# Altium project ARM_V2.PrjPcb (part 2 of 2)

## Sheet POWER.SchDoc: Arm - Power
size Letter; DrawnBy: K.Hong; Organization: UW Robotics; Address1: 200 University Avenue; Address2: Waterloo; Address3: Ontario; Address4: Canada N2L 3G6; SheetNumber: 5; SheetTotal: 9
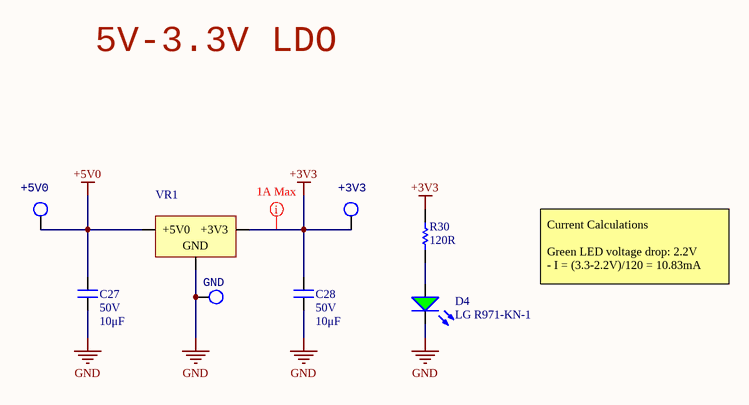
[diagram p5: POWER.SchDoc]

### Parts
+3V3  TESTPOINT_LOOP  [TESTPOINT_LOOP]  (value not drawn)
+5V0  TESTPOINT_LOOP  [TESTPOINT_LOOP]  (value not drawn)
C27  value 10μF  Voltage Rating: 50V  [CAPC1206(3216)]  (hidden comment: 10uF)
C28  value 10μF  Voltage Rating: 50V  [CAPC1206(3216)]  (hidden comment: 10uF)
D4  LG R971-KN-1  [LED_0805_LINE]
GND  TESTPOINT_LOOP  [TESTPOINT_LOOP]  (value not drawn)
R30  value 120R  [RESC0603(1608)_N]  (hidden comment: RES_120R_0603)
VR1  5V0_3V3_LDO  [D2PAK_M]  (value not drawn)

### Nets
+3V3: +3V3.1 C28.1 R30.2 VR1.2(+3V3)
+5V0: +5V0.1 C27.1 VR1.3(+5V0)
GND: C27.2 C28.2 D4.2(K) GND.1 VR1.1(GND)
NetD4_1: D4.1(A) R30.1

### Layout directives
mark named 1A Max: +3V3

### Notes on the sheet
- 5V-3.3V LDO
- Current Calculations
  Green LED voltage drop: 2.2V
  - I = (3.3-2.2V)/120 = 10.83mA
- Title
- Size:
- Date:
- Letter
- Drawn By:
- Sheet
- of
- File:

### Library data of the parts
+3V3 +5V0 GND = TESTPOINT_LOOP: Loop testpoint through-hole pad; Manufacturer Part Number 1: 5002; Manufacturer 1: Keystone Electronics; Supplier Part Number 1: 36-5002-ND; Supplier 1: Digi-Key; Mount: Through Hole
C27 C28 = CAP_10uF_50V_1206: CAP CER 10UF 50V X5R 1206; Manufacturer Part Numer 1: GRT31CR61H106KE01L; Manufacturer 1: Murata; Dimensions: 0.126" L x 0.063" W (3.20mm x 1.6mm); Package: 1206 (3216 Metric); Supplier Part Number 1: 490-12456-1-ND; Supplier 1: Digi-Key; Mount: Surface Mount; Case Code (Imperial): 1206; Case Code (Metric): 3216; Manufacturer Part Number 1: GRT31CR61H106KE01L; Dielectric: X5R
D4 = DIO_LED_G: LED GREEN DIFFUSED 0805 SMD; Manufacturer 1: OSRAM; Forward Voltage Drop: 2.2V; Package: 0805 (2012 Metric); Supplier Part Number 1: 475-1410-1-ND; Supplier 1: Digi-Key; Manufacturer Part Number 1: LG R971-KN-1; Mount: Surface Mount
R30 = RES_120R_0603: RES SMD 120 OHM 5% 1/10W 0603; Manufacturer: Yageo; MPN: RC0603JR-07120RL; Package: 0603 (1608 Metric); Dimensions: 0.063" L x 0.031" W (1.60mm x 0.80mm); Tolerance: 5%; Supplier Part Number 1: 311-120GRCT-ND; Supplier 1: Digi-Key
VR1 = 5V0_3V3_LDO: IC REG LINEAR 3.3V 1A DPAK; Manufacturer Part Number 1: NCP1117DT33T5G; Manufacturer 1: ON Semiconductor; Current Output: 1A; Supplier Part Number 1: NCP1117DT33T5GOSCT-ND; Supplier 1: Digi-Key; Mount: Surface Mount

## Sheet SPI Encoders.SchDoc: Arm - SPI Encoders
size Letter; DrawnBy: N.Chapman, K.Hong; Organization: UW Robotics; Address1: 200 University Avenue; Address2: Waterloo; Address3: Ontario; Address4: Canada N2L 3G6; SheetNumber: 9; SheetTotal: 9
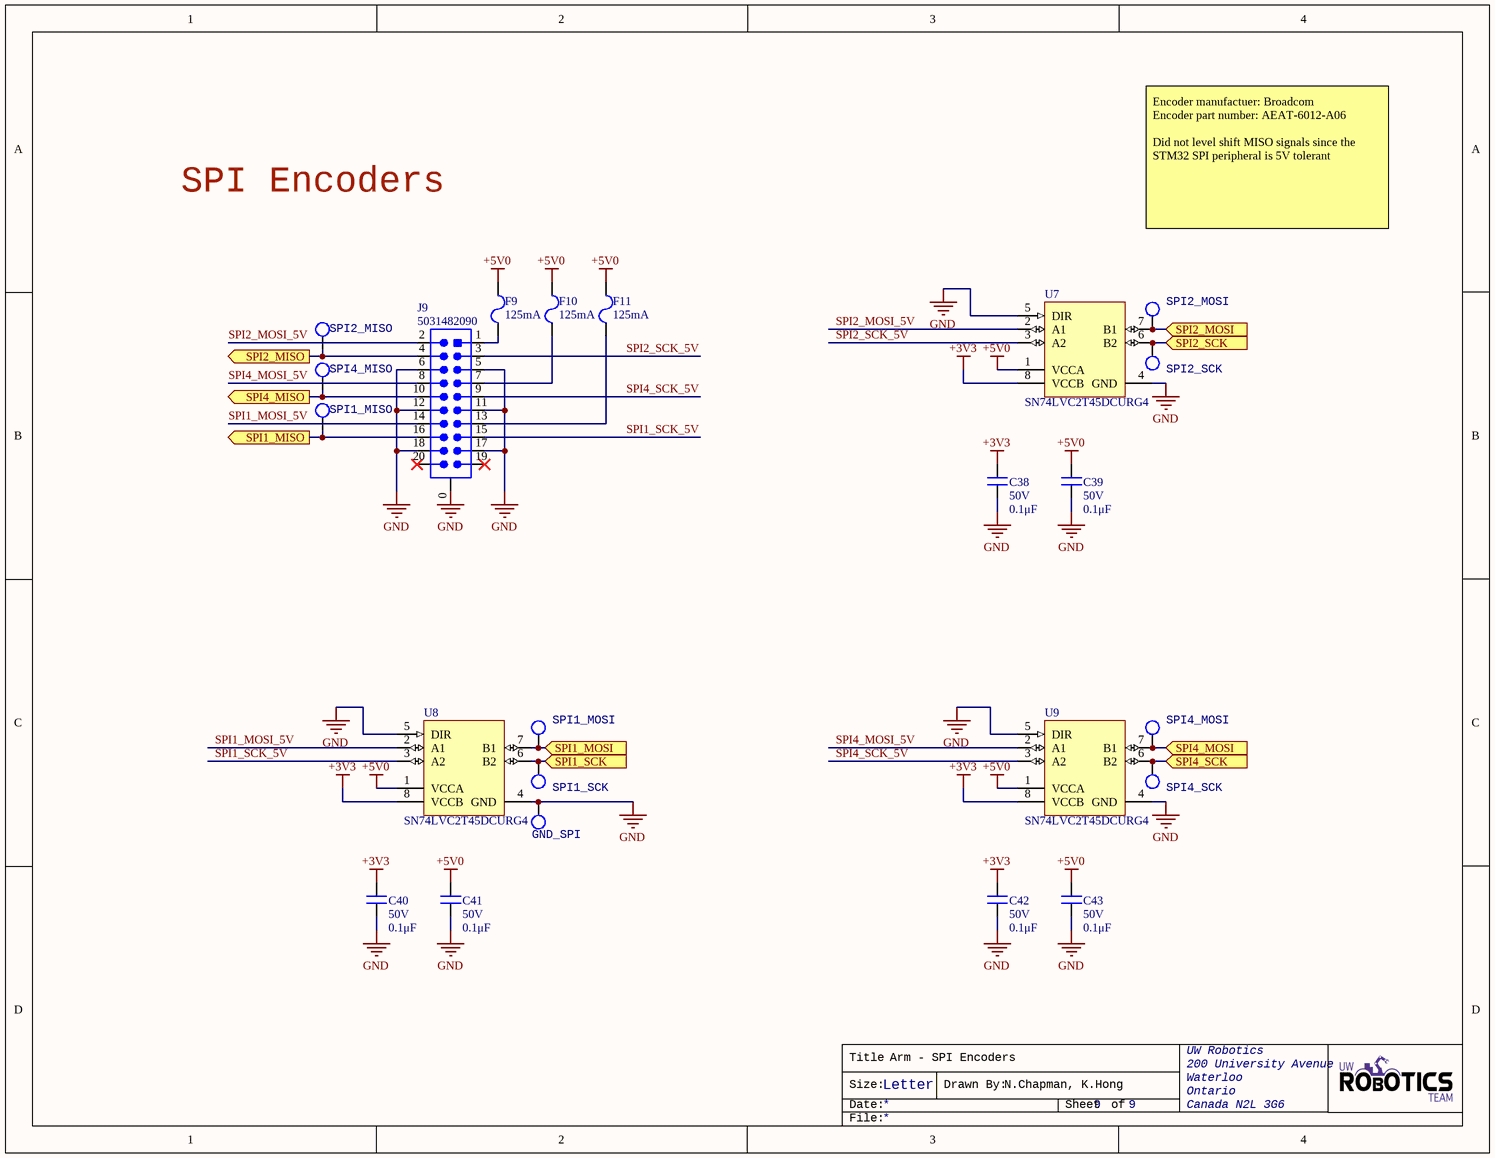
[diagram p6: SPI Encoders.SchDoc]

### Parts
C38  value 0.1μF  Voltage Rating: 50V  [CAPC0603(1608)55_N]  (hidden comment: CAP_0.1uF_50V_0603)
C39  value 0.1μF  Voltage Rating: 50V  [CAPC0603(1608)55_N]  (hidden comment: CAP_0.1uF_50V_0603)
C40  value 0.1μF  Voltage Rating: 50V  [CAPC0603(1608)55_N]  (hidden comment: CAP_0.1uF_50V_0603)
C41  value 0.1μF  Voltage Rating: 50V  [CAPC0603(1608)55_N]  (hidden comment: CAP_0.1uF_50V_0603)
C42  value 0.1μF  Voltage Rating: 50V  [CAPC0603(1608)55_N]  (hidden comment: CAP_0.1uF_50V_0603)
C43  value 0.1μF  Voltage Rating: 50V  [CAPC0603(1608)55_N]  (hidden comment: CAP_0.1uF_50V_0603)
F9  Current Rating: 125mA  [FUSE_1206]  (hidden comment: FUSE_125mA_1206)
F10  Current Rating: 125mA  [FUSE_1206]  (hidden comment: FUSE_125mA_1206)
F11  Current Rating: 125mA  [FUSE_1206]  (hidden comment: FUSE_125mA_1206)
GND_SPI  TESTPOINT_LOOP  [TESTPOINT_LOOP]  (value not drawn)
J9  Manufacturer Part Number 1: 5031482090  [MOLEX-5031482090]  (hidden comment: CON_10x2M_SM_RA)
SPI1_MISO  TESTPOINT_LOOP  [TESTPOINT_LOOP]  (value not drawn)
SPI1_MOSI  TESTPOINT_LOOP  [TESTPOINT_LOOP]  (value not drawn)
SPI1_SCK  TESTPOINT_LOOP  [TESTPOINT_LOOP]  (value not drawn)
SPI2_MISO  TESTPOINT_LOOP  [TESTPOINT_LOOP]  (value not drawn)
SPI2_MOSI  TESTPOINT_LOOP  [TESTPOINT_LOOP]  (value not drawn)
SPI2_SCK  TESTPOINT_LOOP  [TESTPOINT_LOOP]  (value not drawn)
SPI4_MISO  TESTPOINT_LOOP  [TESTPOINT_LOOP]  (value not drawn)
SPI4_MOSI  TESTPOINT_LOOP  [TESTPOINT_LOOP]  (value not drawn)
SPI4_SCK  TESTPOINT_LOOP  [TESTPOINT_LOOP]  (value not drawn)
U7  SN74LVC2T45DCURG4  [DCU0008A_L]
U8  SN74LVC2T45DCURG4  [DCU0008A_L]
U9  SN74LVC2T45DCURG4  [DCU0008A_L]

### Ports
SPI1_MISO (out), SPI1_MOSI (in), SPI1_SCK (in), SPI2_MISO (out), SPI2_MOSI (in), SPI2_SCK (in), SPI4_MISO (out), SPI4_MOSI (in), SPI4_SCK (in)

### Nets
+3V3: C38.2 C40.2 C42.2 U7.8(VCCB) U8.8(VCCB) U9.8(VCCB)
+5V0: C39.2 C41.2 C43.2 F9.1 F10.1 F11.1 U7.1(VCCA) U8.1(VCCA) U9.1(VCCA)
GND: C38.1 C39.1 C40.1 C41.1 C42.1 C43.1 GND_SPI.1 J9.0 J9.5 J9.6 J9.11 J9.12 J9.17 J9.18 U7.4(GND) U7.5(DIR) U8.4(GND) U8.5(DIR) U9.4(GND) U9.5(DIR)
SPI1_MOSI_5V: J9.14 U8.2(A1)
SPI1_SCK_5V: J9.15 U8.3(A2)
SPI2_MOSI_5V: J9.2 U7.2(A1)
SPI2_SCK_5V: J9.3 U7.3(A2)
SPI4_MOSI_5V: J9.8 U9.2(A1)
SPI4_SCK_5V: J9.9 U9.3(A2)
NetF9_2: F9.2 J9.1
NetF10_2: F10.2 J9.7
NetF11_2: F11.2 J9.13
NetJ9_4: J9.4 SPI2_MISO.1 ; port SPI2_MISO
NetJ9_10: J9.10 SPI4_MISO.1 ; port SPI4_MISO
NetJ9_16: J9.16 SPI1_MISO.1 ; port SPI1_MISO
NetSPI1_MOSI_1: SPI1_MOSI.1 U8.7(B1) ; port SPI1_MOSI
NetSPI1_SCK_1: SPI1_SCK.1 U8.6(B2) ; port SPI1_SCK
NetSPI2_MOSI_1: SPI2_MOSI.1 U7.7(B1) ; port SPI2_MOSI
NetSPI2_SCK_1: SPI2_SCK.1 U7.6(B2) ; port SPI2_SCK
NetSPI4_MOSI_1: SPI4_MOSI.1 U9.7(B1) ; port SPI4_MOSI
NetSPI4_SCK_1: SPI4_SCK.1 U9.6(B2) ; port SPI4_SCK

Not connected (* = marked no-connect by the designer): J9 19* 20*

### Notes on the sheet
- SPI Encoders
- Encoder manufactuer: Broadcom
  Encoder part number: AEAT-6012-A06
  Did not level shift MISO signals since the STM32 SPI peripheral is 5V tolerant
- Title
- Size:
- Date:
- Letter
- Drawn By:
- Sheet
- of
- File:

### Library data of the parts
C38-C43 = CAP_0.1uF_50V_0603: CAP CER 0.1UF 50V X7R 0603; Manufacturer Part Number 1: CC0603KRX7R9BB104; Manufacturer 1: Yageo; Dimensions: 0.063" L x 0.031" W (1.60mm x 0.80mm); Package: 0603 (1608 Metric); Temperature Coefficient: X7R; Supplier Part Number 1: 311-1344-1-ND; Supplier 1: Digi-Key; Mount: Surface Mount; Case Code (Imperial): 0603; Case Code (Metric): 1608; Dielectric: X7R
F9-F11 = FUSE_125mA_1206: FUSE SMD 125mA 125V; Manufacturer 1: Littelfuse; Manufacturer Part Number 1: 0466.125NRHF; DC Cold Resistance: 4R; Fuse Type: Board Mount (Cartridge Style Excluded); Power Dissipation: 69.1mW; Approvals: UL,CSA; Supplier 1: Digi-Key; Stock 1: 10036; Pricing 1: 1=0.84000, 5=0.81200, 10=0.78700, 50=0.66180, 100=0.54930, 250=0.49940, 500=0.42450, 1000=0.37455 (USD); RoHS: Yes; Mount: Surface Mount; Case/Package: 1206; Case Code (Metric): 3216; Case Code (Imperial): 1206; Housing Material: Ceramic; Min Operating Temperature: -55°C; Max Operating Temperature: 90°C; Packaging: Tape and Reel; Voltage Rating (AC): 125V; Voltage Rating (DC): 125V; Working Voltage: 125V; Package Quantity: 5000; Length: 3.18mm; Height: 0.023inch; Depth: 1.52mm; Width: 0.06inch; Lead Free: Lead Free; ComponentLink1URL: https://datasheet.ciiva.com/303/littelfuse-fuse-466-303205.pdf?src-supplier=Digi-Key; ComponentLink1Description: https://datasheet.ciiva.com/303/littelfuse-fuse-466-303205.pdf?src-supplier=Digi-Key; Supplier Part Number 1: F6016CT-ND
GND_SPI SPI1_MISO SPI1_MOSI SPI1_SCK SPI2_MISO SPI2_MOSI SPI2_SCK SPI4_MISO SPI4_MOSI SPI4_SCK = TESTPOINT_LOOP: as +3V3 on sheet POWER; Supplier Part Number 1: 36-5002-ND; Supplier 1: Digi-Key; Mount: Through Hole
J9 = CON_10x2M_SM_RA: CONN HEADER SMD RIGHT ANGLE 1.5MM PITCH; Manufacturer 1: Molex; Voltage Rating: 100V; Current Rating: 1A; Connector Type: Receptacle,Forked,Center Strip Contact; Number of Positions: 20; Gender: Receptacle; Glow Wire Compliant: Non-compliant; Supplier 1: Digi-Key; Stock 1: 1742; Pricing 1: 1=2.37000, 10=2.14700, 100=1.83990 (USD); RoHS: Yes; Mount: Surface Mount,Through Hole; Housing Material: Resin; Color: Beige; Housing Color: Beige; Contact Material: Copper Alloy,Copper,Tin; Contact Plating: Tin; Min Operating Temperature: -25°C; Max Operating Temperature: 85°C; Number of Rows: 2; Packaging: Tape and Reel; Package Quantity: 550; Fastening Type: Latch; Orientation: Right Angle; Termination: Solder; Number of Contacts: 20; Contact Gender: Female; Number of Circuits: 20; Length: 19.3mm; Pitch: 1.5mm; Row Spacing: 1.5mm; Depth: 9.55mm; Radiation Hardening: No; REACH SVHC: No SVHC; ComponentLink1URL: https://datasheet.ciiva.com/6787/5031482090-sd-6787557.pdf?src-supplier=Digi-Key; ComponentLink1Description: https://datasheet.ciiva.com/6787/5031482090-sd-6787557.pdf?src-supplier=Digi-Key; ComponentLink2URL: https://datasheet.ciiva.com/10076/5031482090-pcb-receptacles-10076785.pdf?src-supplier=Avnet; ComponentLink2Description: https://datasheet.ciiva.com/10076/5031482090-pcb-receptacles-10076785.pdf?src-supplier=Avnet; ComponentLink3URL: https://datasheet.ciiva.com/5153/5031482090-pcb-receptacles-179510-5153198.pdf?src-supplier=Mouser; ComponentLink3Description: https://datasheet.ciiva.com/5153/5031482090-pcb-receptacles-179510-5153198.pdf?src-supplier=Mouser; ComponentLink4URL: https://datasheet.ciiva.com/30082/72715031482090-pcb-receptacles-30082526.pdf?src-supplier=Onlinecomponents.com; ComponentLink4Description: https://datasheet.ciiva.com/30082/72715031482090-pcb-receptacles-30082526.pdf?src-supplier=Onlinecomponents.com; ComponentLink5URL: https://datasheet.ciiva.com/6787/5031482090-sd-6787542.pdf?src-supplier=Digi-Key; ComponentLink5Description: https://datasheet.ciiva.com/6787/5031482090-sd-6787542.pdf?src-supplier=Digi-Key; ComponentLink6URL: https://datasheet.ciiva.com/6787/5031482090-sd-6787548.pdf?src-supplier=Digi-Key; ComponentLink6Description: https://datasheet.ciiva.com/6787/5031482090-sd-6787548.pdf?src-supplier=Digi-Key; Supplier Part Number 1: WM9451CT-ND
U7-U9 = CMP-0859-00013-4: Dual-Bit Dual Supply Transceiver with Configurable Voltage Translation and 3-State Outputs, DCU0008A, LARGE T&R; Manufacturer: Texas Instruments; tpd @ Nom Voltage(Max)(ns): 17.7,10.3,8.3,7.2; Logic: True; Rating: Military; ICC @ Nom Voltage(Max)(mA): 0.004; Bits(#): 2; 3-State Output: Yes; Schmitt Trigger: No; Technology Family: LVC; Sub-Family: Dual Supply Translator; Output Drive (IOL/IOH)(Max)(mA): 32/-32; Output Type: CMOS; VCC(Max)(V): 5.5; Input Type: CMOS/TTL; F @ Nom Voltage(Max)(Mhz): 150; VCC(Min)(V): 1.65; Voltage(Nom)(V): 1.8,2.5,3.3,5; PackageReference: DCU0008A; Generic Part Number: SN74LVC2T45; DatasheetVersion: SCES516J; Operating Temperature Range(C): -40 to 85

## Sheet Support.SchDoc: Arm - Support
size Letter; DrawnBy: N.Chapman, K.Hong; Organization: UW Robotics; Address1: 200 University Avenue; Address2: Waterloo; Address3: Ontario; Address4: Canada N2L 3G6; SheetNumber: 6; SheetTotal: 9
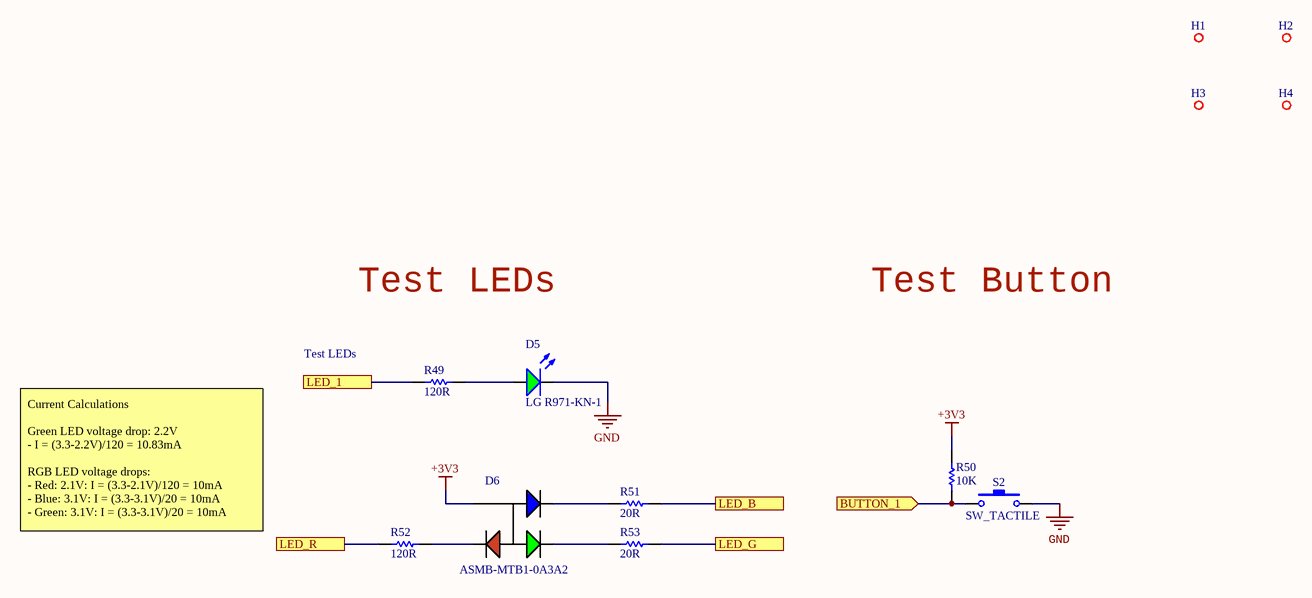
[diagram p7: Support.SchDoc]

### Parts
D5  LG R971-KN-1  [LED_0805_LINE]
D6  Manufacturer Part Number 1: ASMB-MTB1-0A3A2  [LED_RGB]  (hidden comment: LED_RGB)
H1  MOUNTING_HOLES  [MOUNTING_HOLE]  (value not drawn)
H2  MOUNTING_HOLES  [MOUNTING_HOLE]  (value not drawn)
H3  MOUNTING_HOLES  [MOUNTING_HOLE]  (value not drawn)
H4  MOUNTING_HOLES  [MOUNTING_HOLE]  (value not drawn)
R49  value 120R  [RESC0603(1608)_N]  (hidden comment: RES_120R_0603)
R50  value 10K  [RESC0603(1608)_N]  (hidden comment: RES_10K_0603)
R51  value 20R  [RESC0603(1608)_N]  (hidden comment: RES_20R_0603)
R52  value 120R  [RESC0603(1608)_N]  (hidden comment: RES_120R_0603)
R53  value 20R  [RESC0603(1608)_N]  (hidden comment: RES_20R_0603)
S2  SW_TACTILE  [B3U-1000P]

### Ports
BUTTON_1 (in), LED_1, LED_B, LED_G, LED_R

### Nets
+3V3: D6.4 R50.2
GND: D5.2(K) S2.2
NetD5_1: D5.1(A) R49.2
NetD6_1: D6.1 R52.2
NetD6_2: D6.2 R53.1
NetD6_3: D6.3 R51.1
NetR49_1: R49.1 ; port LED_1
NetR50_1: R50.1 S2.1 ; port BUTTON_1
NetR51_2: R51.2 ; port LED_B
NetR52_1: R52.1 ; port LED_R
NetR53_2: R53.2 ; port LED_G

### Notes on the sheet
- Test LEDs
- Test Button
- Current Calculations
  Green LED voltage drop: 2.2V
  - I = (3.3-2.2V)/120 = 10.83mA
  RGB LED voltage drops:
  - Red: 2.1V: I = (3.3-2.1V)/120 = 10mA
  - Blue: 3.1V: I = (3.3-3.1V)/20 = 10mA
  - Green: 3.1V: I = (3.3-3.1V)/20 = 10mA
- Title
- Size:
- Date:
- Letter
- Drawn By:
- Sheet
- of
- File:

### Library data of the parts
D5 = DIO_LED_G: as D4 on sheet POWER; Package: 0805 (2012 Metric); Supplier Part Number 1: 475-1410-1-ND; Supplier 1: Digi-Key; Manufacturer Part Number 1: LG R971-KN-1; Mount: Surface Mount
D6 = LED_RGB: LED RGB DIFFUSED 4PLCC SMD; Manufacturer 1: Broadcom; Color: Blue,Green,Red; Lens Color: White; Viewing Angle: 115°; Lens Style: Round; Luminous Intensity: 350mcd; Dominant Wavelength: 470nm; Forward Voltage: 3.1V; Test Current: 20mA; Supplier 1: Digi-Key; Stock 1: 142531; Pricing 1: 1=0.60000, 10=0.47100, 100=0.30210, 500=0.25980, 1000=0.20059 (USD); RoHS: Yes; Mount: Surface Mount; Case/Package: PLCC; Number of Pins: 4; Packaging: Cut Tape; Lens Transparency: Diffused; Length: 3.2mm; Height: 1.9mm; Width: 2.8mm; REACH SVHC: No SVHC; ComponentLink1URL: http://www.farnell.com/datasheets/2111106.pdf?src-supplier=Farnell; ComponentLink1Description: http://www.farnell.com/datasheets/2111106.pdf?src-supplier=Farnell; ComponentLink2URL: https://docs.broadcom.com/docs/AV02-4194EN?src-supplier=Digi-Key; ComponentLink2Description: https://docs.broadcom.com/docs/AV02-4194EN?src-supplier=Digi-Key; ComponentLink3URL: http://www.farnell.com/datasheets/1801564.pdf?src-supplier=Element14; ComponentLink3Description: http://www.farnell.com/datasheets/1801564.pdf?src-supplier=Element14; ComponentLink4URL: http://www.farnell.com/datasheets/2111106.pdf?src-supplier=Newark; ComponentLink4Description: http://www.farnell.com/datasheets/2111106.pdf?src-supplier=Newark; Supplier Part Number 1: 516-3280-1-ND
H1-H4 = MOUNTING_HOLES: 6cm x 6cm
R49 R52 = RES_120R_0603: as R30 on sheet POWER; Package: 0603 (1608 Metric); Dimensions: 0.063" L x 0.031" W (1.60mm x 0.80mm); Tolerance: 5%; Supplier Part Number 1: 311-120GRCT-ND; Supplier 1: Digi-Key
R50 = RES_10K_0603: RES SMD 10K OHM 5% 1/10W 0603; Manufacturer: Yageo; MPN: RC0603JR-0710KL; Package: 0603 (1608 Metric); Dimensions: 0.063" L x 0.031" W (1.60mm x 0.80mm); Tolerance: 5%; Supplier Part Number 1: 311-10KGRCT-ND; Supplier 1: Digi-Key
R51 R53 = RES_20R_0603: RES SMD 20 OHM 5% 1/10W 0603; Manufacturer: Yageo; MPN: RC0603JR-0720RL; Package: 0603 (1608 Metric); Dimensions: 0.063" L x 0.031" W (1.60mm x 0.80mm); Tolerance: 5%; Supplier Part Number 1: 311-20GRCT-ND; Supplier 1: Digi-Key
S2 = SW_TACTILE: Tactile Switch (Grey); Manufacturer 1: Omron Electronics Inc-EMC Div; Supplier Part Number 1: SW1020CT-ND; Supplier 1: Digi-Key; Manufacturer Part Number 1: B3U-1000P; Mount: Surface Mount

## Sheet Servo and Encoders.SchDoc
size Letter; DrawnBy: Kyle Hong
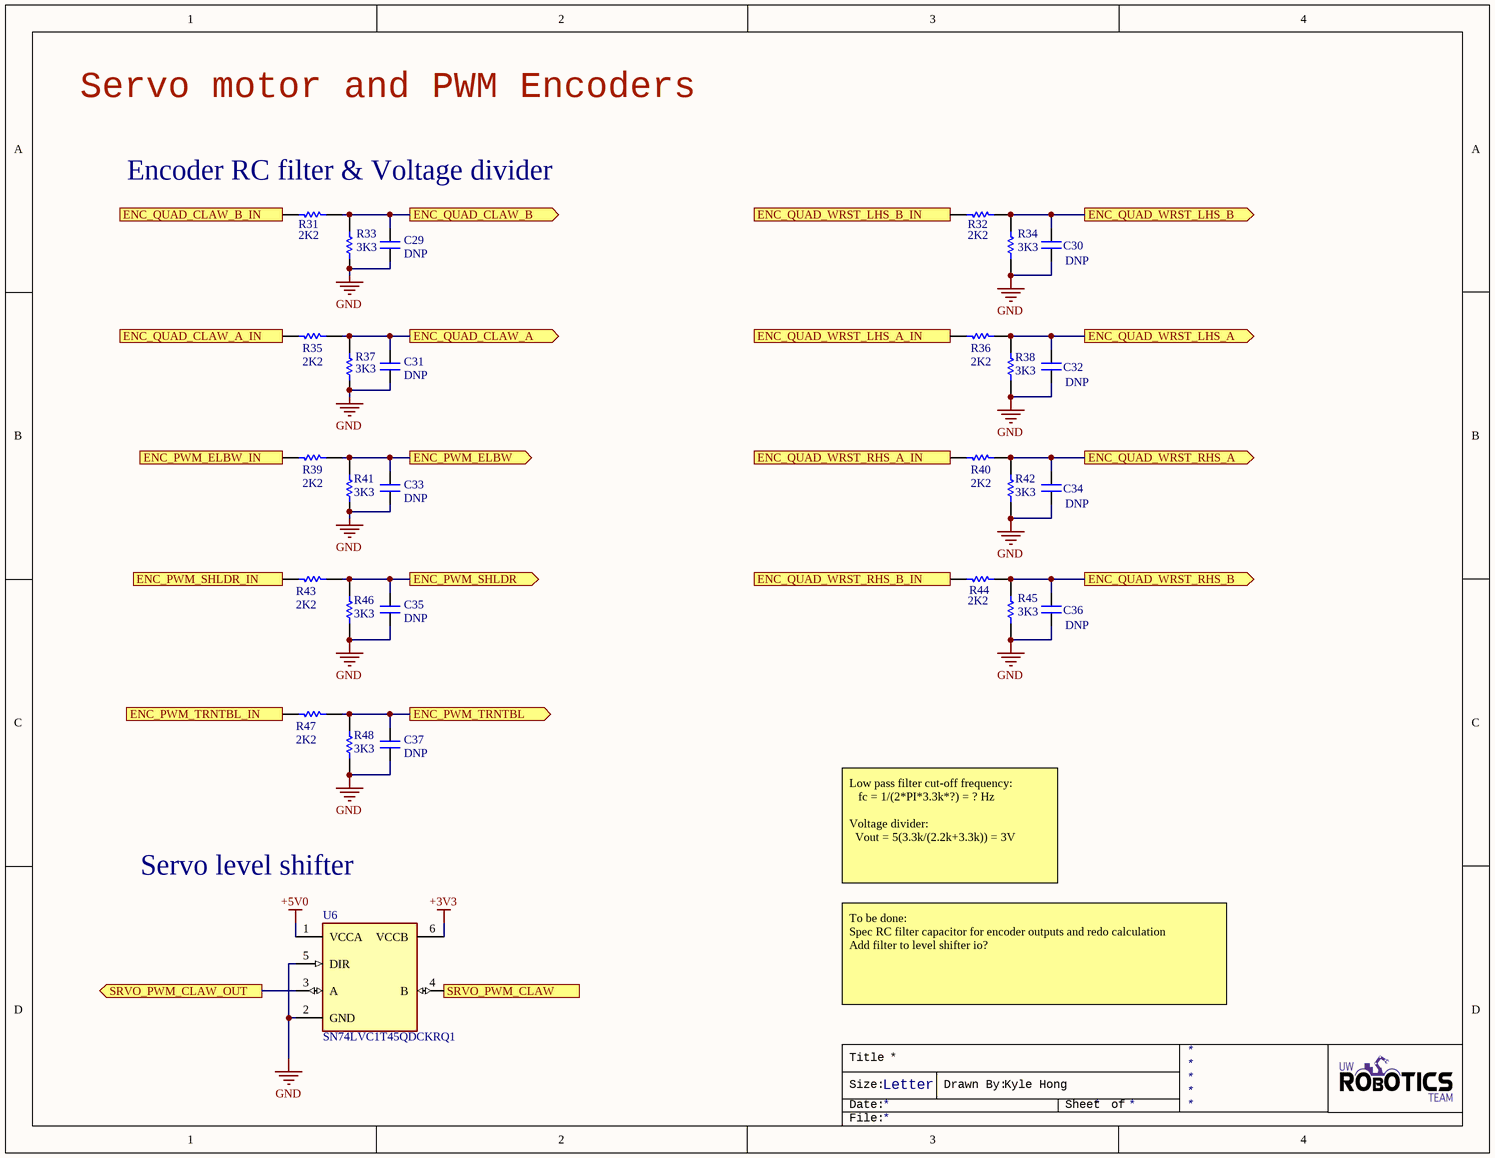
[diagram p8: Servo and Encoders.SchDoc]

### Parts
C29  value DNP  [CAPC0603(1608)55_N]  (hidden comment: CAP_DNP_0603_1_1)
C30  value DNP  [CAPC0603(1608)55_N]  (hidden comment: CAP_DNP_0603_1_1)
C31  value DNP  [CAPC0603(1608)55_N]  (hidden comment: CAP_DNP_0603_1_1)
C32  value DNP  [CAPC0603(1608)55_N]  (hidden comment: CAP_DNP_0603_1_1)
C33  value DNP  [CAPC0603(1608)55_N]  (hidden comment: CAP_DNP_0603_1_1)
C34  value DNP  [CAPC0603(1608)55_N]  (hidden comment: CAP_DNP_0603_1_1)
C35  value DNP  [CAPC0603(1608)55_N]  (hidden comment: CAP_DNP_0603_1_1)
C36  value DNP  [CAPC0603(1608)55_N]  (hidden comment: CAP_DNP_0603_1_1)
C37  value DNP  [CAPC0603(1608)55_N]  (hidden comment: CAP_DNP_0603_1_1)
R31  value 2K2  [RESC0603(1608)_N]  (hidden comment: RES_2K2_0603)
R32  value 2K2  [RESC0603(1608)_N]  (hidden comment: RES_2K2_0603)
R33  value 3K3  [RESC0603(1608)_N]  (hidden comment: RES_3K3_0603)
R34  value 3K3  [RESC0603(1608)_N]  (hidden comment: RES_3K3_0603)
R35  value 2K2  [RESC0603(1608)_N]  (hidden comment: RES_2K2_0603)
R36  value 2K2  [RESC0603(1608)_N]  (hidden comment: RES_2K2_0603)
R37  value 3K3  [RESC0603(1608)_N]  (hidden comment: RES_3K3_0603)
R38  value 3K3  [RESC0603(1608)_N]  (hidden comment: RES_3K3_0603)
R39  value 2K2  [RESC0603(1608)_N]  (hidden comment: RES_2K2_0603)
R40  value 2K2  [RESC0603(1608)_N]  (hidden comment: RES_2K2_0603)
R41  value 3K3  [RESC0603(1608)_N]  (hidden comment: RES_3K3_0603)
R42  value 3K3  [RESC0603(1608)_N]  (hidden comment: RES_3K3_0603)
R43  value 2K2  [RESC0603(1608)_N]  (hidden comment: RES_2K2_0603)
R44  value 2K2  [RESC0603(1608)_N]  (hidden comment: RES_2K2_0603)
R45  value 3K3  [RESC0603(1608)_N]  (hidden comment: RES_3K3_0603)
R46  value 3K3  [RESC0603(1608)_N]  (hidden comment: RES_3K3_0603)
R47  value 2K2  [RESC0603(1608)_N]  (hidden comment: RES_2K2_0603)
R48  value 3K3  [RESC0603(1608)_N]  (hidden comment: RES_3K3_0603)
U6  SN74LVC1T45QDCKRQ1  [SOT65P210X110-6N]

### Ports
ENC_PWM_ELBW (out), ENC_PWM_ELBW_IN (in), ENC_PWM_SHLDR (out), ENC_PWM_SHLDR_IN (in), ENC_PWM_TRNTBL (out), ENC_PWM_TRNTBL_IN (in), ENC_QUAD_CLAW_A (out), ENC_QUAD_CLAW_A_IN (in), ENC_QUAD_CLAW_B (out), ENC_QUAD_CLAW_B_IN (in), ENC_QUAD_WRST_LHS_A (out), ENC_QUAD_WRST_LHS_A_IN (in), ENC_QUAD_WRST_LHS_B (out), ENC_QUAD_WRST_LHS_B_IN (in), ENC_QUAD_WRST_RHS_A (out), ENC_QUAD_WRST_RHS_A_IN (in), ENC_QUAD_WRST_RHS_B (out), ENC_QUAD_WRST_RHS_B_IN (in), SRVO_PWM_CLAW (in), SRVO_PWM_CLAW_OUT (out)

### Nets
+3V3: U6.6(VCCB)
+5V0: U6.1(VCCA)
GND: C29.1 C30.1 C31.1 C32.1 C33.1 C34.1 C35.1 C36.1 C37.1 R33.1 R34.1 R37.1 R38.1 R41.1 R42.1 R45.1 R46.1 R48.1 U6.2(GND) U6.5(DIR)
NetC29_2: C29.2 R31.1 R33.2 ; port ENC_QUAD_CLAW_B
NetC30_2: C30.2 R32.1 R34.2 ; port ENC_QUAD_WRST_LHS_B
NetC31_2: C31.2 R35.1 R37.2 ; port ENC_QUAD_CLAW_A
NetC32_2: C32.2 R36.1 R38.2 ; port ENC_QUAD_WRST_LHS_A
NetC33_2: C33.2 R39.1 R41.2 ; port ENC_PWM_ELBW
NetC34_2: C34.2 R40.1 R42.2 ; port ENC_QUAD_WRST_RHS_A
NetC35_2: C35.2 R43.1 R46.2 ; port ENC_PWM_SHLDR
NetC36_2: C36.2 R44.1 R45.2 ; port ENC_QUAD_WRST_RHS_B
NetC37_2: C37.2 R47.1 R48.2 ; port ENC_PWM_TRNTBL
NetJ2_3: R39.2 ; port ENC_PWM_ELBW_IN
NetJ2_11: R31.2 ; port ENC_QUAD_CLAW_B_IN
NetJ2_13: R35.2 ; port ENC_QUAD_CLAW_A_IN
NetJ2_19: U6.3(A) ; port SRVO_PWM_CLAW_OUT
NetJ3_9: R32.2 ; port ENC_QUAD_WRST_LHS_B_IN
NetJ3_11: R36.2 ; port ENC_QUAD_WRST_LHS_A_IN
NetJ3_13: R44.2 ; port ENC_QUAD_WRST_RHS_B_IN
NetJ3_15: R40.2 ; port ENC_QUAD_WRST_RHS_A_IN
NetJ5_7: R47.2 ; port ENC_PWM_TRNTBL_IN
NetJ5_19: R43.2 ; port ENC_PWM_SHLDR_IN
NetU5_32: U6.4(B) ; port SRVO_PWM_CLAW

### Notes on the sheet
- Servo motor and PWM Encoders
- Encoder RC filter & Voltage divider
- Servo level shifter
- Low pass filter cut-off frequency:
  fc = 1/(2*PI*3.3k*?) = ? Hz
  Voltage divider:
  Vout = 5(3.3k/(2.2k+3.3k)) = 3V
- To be done:
  Spec RC filter capacitor for encoder outputs and redo calculation
  Add filter to level shifter io?
- Title
- Size:
- Date:
- Letter
- Drawn By:
- Sheet
- of
- File:

### Library data of the parts
C29-C37 = CAP_DNP_0603_1_1: CAP DNP 0603; Dimensions: 0.063" L x 0.031" W (1.60mm x 0.80mm); Package: 0603 (1608 Metric)
R31 R32 R35 R36 R39 R40 R43 R44 R47 = RES_2K2_0603: RES SMD 2.2K OHM 1% 1/10W 0603; Manufacturer: Yageo; MPN: RC0603FR-072K2L; Dimensions: 0.063" L x 0.031" W (1.60mm x 0.80mm); Package: 0603 (1608 Metric); Tolerance: 1%; Supplier 1: Digi-Key; Supplier Part Number 1: 311-2.20KHRCT-ND
R33 R34 R37 R38 R41 R42 R45 R46 R48 = RES_3K3_0603: RES SMD 3.3K OHM 5% 1/10W 0603; Manufacturer: Yageo; MPN: RC0603JR-073K3L; Dimensions: 0.063" L x 0.031" W (1.60mm x 0.80mm); Package: 0603 (1608 Metric); Tolerance: 5%; Supplier Part Number 1: 311-3.3KGRCT-ND; Supplier 1: Digi-Key; Digikey Part Number: 311-3.3KGRCT-ND
U6 = IC_LVL_SHIFTER_TI: IC BIDIRECTIONAL LEVEL SHIFTER; Manufacturer 1: Texas Instruments; Data Rate: 420Mbps; Number of Channels: 1; Logic Function: Translator; Turn-On Delay Time: 6.9ns; High Level Output Current: -32mA; Low Level Output Current: 32mA; Quiescent Current: 10uA; Max Supply Voltage: 5.5V; Min Supply Voltage: 1.65V; Supplier 1: Digi-Key; Manufacturer Part Number 1: SN74LVC1T45QDCKRQ1; Stock 1: 7633; Pricing 1: 1=0.59000, 10=0.51500, 25=0.48360, 100=0.39470, 250=0.36660, 500=0.31200, 1000=0.24960 (USD); RoHS: Yes; Mount: Surface Mount; Case/Package: SC; Number of Pins: 6; Weight: 0.000988oz; Min Operating Temperature: -40°C; Max Operating Temperature: 125°C; Number of Bits: 1; Channel Type: Bidirectional; Number of Circuits: 1; Packaging: Tape and Reel; Propagation Delay: 6.9ns; Package Quantity: 3000; Radiation Hardening: No; Lead Free: Lead Free; REACH SVHC: No SVHC; ComponentLink1URL: https://datasheet.ciiva.com/6615/sn74lvc1t45-q1-6615008.pdf?src-supplier=Digi-Key; ComponentLink1Description: https://datasheet.ciiva.com/6615/sn74lvc1t45-q1-6615008.pdf?src-supplier=Digi-Key; ComponentLink2URL: https://datasheet.ciiva.com/12072/sces677b-213901-12072996.pdf?src-supplier=Mouser; ComponentLink2Description: https://datasheet.ciiva.com/12072/sces677b-213901-12072996.pdf?src-supplier=Mouser; ComponentLink3URL: https://datasheet.ciiva.com/15096/getdatasheetpartid-701994-15096516.pdf?src-supplier=Verical; ComponentLink3Description: https://datasheet.ciiva.com/15096/getdatasheetpartid-701994-15096516.pdf?src-supplier=Verical; ComponentLink4URL: https://datasheet.ciiva.com/29887/sn74lvc1t45-q1-29887614.pdf?src-supplier=Avnet; ComponentLink4Description: https://datasheet.ciiva.com/29887/sn74lvc1t45-q1-29887614.pdf?src-supplier=Avnet; Supplier Part Number 1: 296-39212-1-ND

## Nets that join several sheets
+3V3: CAN (C3.2 C4.2 U1.4 U2.4), FSR (5 pins), Integrated Connectors (12 pins), MCU (20 pins), POWER (+3V3.1 C28.1 R30.2 VR1.2), SPI Encoders (6 pins), Support (D6.4 R50.2), Servo and Encoders (U6.6)
+5V0: Integrated Connectors (8 pins), POWER (+5V0.1 C27.1 VR1.3), SPI Encoders (9 pins), Servo and Encoders (U6.1)
GND: CAN (11 pins), FSR (11 pins), Integrated Connectors (52 pins), MCU (25 pins), POWER (5 pins), SPI Encoders (20 pins), Support (D5.2 S2.2), Servo and Encoders (20 pins)
CAN1_N: CAN (C2.2 CAN1_N.1 CMC1.5), Integrated Connectors (D3.2 J6.3 J6.4)
CAN1_P: CAN (C1.2 CAN1_P.1 CMC1.4), Integrated Connectors (D3.1 J6.1 J6.2)
CAN2_N: CAN (C6.2 CAN2_N.1 CMC2.5), Integrated Connectors (D2.2 J6.11 J6.12)
CAN2_P: CAN (C5.2 CAN2_P.1 CMC2.4), Integrated Connectors (D2.1 J6.9 J6.10)
NetC7_2: FSR (5 pins), MCU (U5.16)
NetC24_2: Integrated Connectors (J8.8), MCU (C24.2 S1.2 U5.14)
NetC29_2: MCU (U5.42), Servo and Encoders (C29.2 R31.1 R33.2)
NetC30_2: MCU (U5.24), Servo and Encoders (C30.2 R32.1 R34.2)
NetC31_2: MCU (U5.40), Servo and Encoders (C31.2 R35.1 R37.2)
NetC32_2: MCU (U5.23), Servo and Encoders (C32.2 R36.1 R38.2)
NetC33_2: MCU (U5.53), Servo and Encoders (C33.2 R39.1 R41.2)
NetC34_2: MCU (U5.90), Servo and Encoders (C34.2 R40.1 R42.2)
NetC35_2: MCU (U5.63), Servo and Encoders (C35.2 R43.1 R46.2)
NetC36_2: MCU (U5.64), Servo and Encoders (C36.2 R44.1 R45.2)
NetC37_2: MCU (U5.25), Servo and Encoders (C37.2 R47.1 R48.2)
NetFSR1-1_1: FSR (FSR1-1.1 FSR2-1.1), Integrated Connectors (J3.19)
NetJ1_1: Integrated Connectors (J1.1), MCU (U5.97)
NetJ1_2: Integrated Connectors (J1.2 R19.2), MCU (U5.95)
NetJ1_3: Integrated Connectors (J1.3), MCU (U5.98)
NetJ1_4: Integrated Connectors (J1.4 R20.2), MCU (U5.96)
NetJ2_3: Integrated Connectors (J2.3), Servo and Encoders (R39.2)
NetJ2_5: Integrated Connectors (J2.5 R13.1), MCU (U5.45)
NetJ2_7: Integrated Connectors (J2.7 R14.1), MCU (U5.44)
NetJ2_11: Integrated Connectors (J2.11), Servo and Encoders (R31.2)
NetJ2_13: Integrated Connectors (J2.13), Servo and Encoders (R35.2)
NetJ2_15: Integrated Connectors (J2.15 R15.1), MCU (U5.36)
NetJ2_19: Integrated Connectors (J2.19), Servo and Encoders (U6.3)
NetJ3_1: Integrated Connectors (J3.1 R16.1), MCU (U5.30)
NetJ3_3: Integrated Connectors (J3.3 R17.1), MCU (U5.29)
NetJ3_5: Integrated Connectors (J3.5 R18.1), MCU (U5.26)
NetJ3_9: Integrated Connectors (J3.9), Servo and Encoders (R32.2)
NetJ3_11: Integrated Connectors (J3.11), Servo and Encoders (R36.2)
NetJ3_13: Integrated Connectors (J3.13), Servo and Encoders (R44.2)
NetJ3_15: Integrated Connectors (J3.15), Servo and Encoders (R40.2)
NetJ4_1: Integrated Connectors (J4.1 R28.2), MCU (U5.62)
NetJ4_2: Integrated Connectors (J4.2 R25.2), MCU (U5.61)
NetJ4_3: Integrated Connectors (J4.3 R27.2), MCU (U5.60)
NetJ4_4: Integrated Connectors (J4.4 R26.2), MCU (U5.59)
NetJ4_7: Integrated Connectors (J4.7), MCU (U5.58)
NetJ4_8: Integrated Connectors (J4.8), MCU (U5.57)
NetJ4_9: Integrated Connectors (J4.9), MCU (U5.56)
NetJ4_10: Integrated Connectors (J4.10), MCU (U5.55)
NetJ5_7: Integrated Connectors (J5.7), Servo and Encoders (R47.2)
NetJ5_9: Integrated Connectors (J5.9 R24.1), MCU (U5.87)
NetJ5_11: Integrated Connectors (J5.11 R23.1), MCU (U5.86)
NetJ5_13: Integrated Connectors (J5.13 R22.1), MCU (U5.84)
NetJ5_15: Integrated Connectors (J5.15 R21.1), MCU (U5.83)
NetJ5_19: Integrated Connectors (J5.19), Servo and Encoders (R43.2)
NetJ8_2: Integrated Connectors (J8.2), MCU (SERIAL_TX.1 U5.39)
NetJ8_3: Integrated Connectors (J8.3), MCU (SERIAL_RX.1 U5.38)
NetJ8_4: Integrated Connectors (J8.4), MCU (U5.65)
NetJ8_6: Integrated Connectors (J8.6), MCU (U5.72)
NetJ8_7: Integrated Connectors (J8.7), MCU (U5.76)
NetJ9_4: MCU (U5.17), SPI Encoders (J9.4 SPI2_MISO.1)
NetJ9_10: MCU (U5.4), SPI Encoders (J9.10 SPI4_MISO.1)
NetJ9_16: MCU (U5.31), SPI Encoders (J9.16 SPI1_MISO.1)
NetR49_1: MCU (U5.8), Support (R49.1)
NetR50_1: MCU (U5.2), Support (R50.1 S2.1)
NetR51_2: MCU (U5.35), Support (R51.2)
NetR52_1: MCU (U5.9), Support (R52.1)
NetR53_2: MCU (U5.34), Support (R53.2)
NetSPI1_MOSI_1: MCU (U5.91), SPI Encoders (SPI1_MOSI.1 U8.7)
NetSPI1_SCK_1: MCU (U5.89), SPI Encoders (SPI1_SCK.1 U8.6)
NetSPI2_MOSI_1: MCU (U5.18), SPI Encoders (SPI2_MOSI.1 U7.7)
NetSPI2_SCK_1: MCU (U5.47), SPI Encoders (SPI2_SCK.1 U7.6)
NetSPI4_MOSI_1: MCU (U5.5), SPI Encoders (SPI4_MOSI.1 U9.7)
NetSPI4_SCK_1: MCU (U5.1), SPI Encoders (SPI4_SCK.1 U9.6)
NetU1_2: CAN (U1.2), MCU (U5.70)
NetU1_3: CAN (U1.3), MCU (U5.71)
NetU2_2: CAN (U2.2), MCU (U5.51)
NetU2_3: CAN (U2.3), MCU (U5.52)
NetU5_32: MCU (U5.32), Servo and Encoders (U6.4)